# EAGLE design pishield1 (EAGLE 7.6.0)

## Sheet 1 of 2
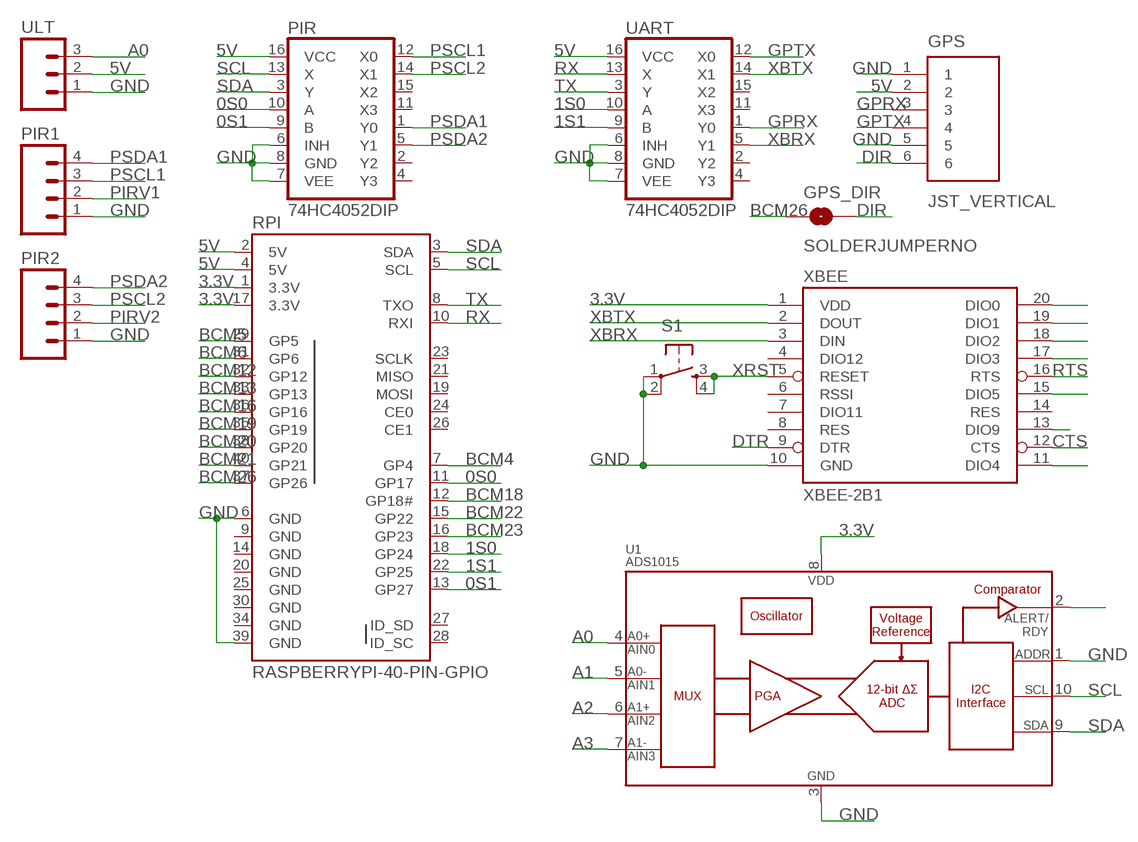
[diagram p0: schematic, sheet 1]

### Parts
GPS  JST_VERTICAL  [JST-6-SMD-VERT-1.0MM]
GPS_DIR  SOLDERJUMPERNO  [SJ_2S-NO]
PIR  74HC4052DIP  [DIL16]
PIR1  M04PTH  [1X04]
PIR2  M04PTH  [1X04]
RPI  RASPBERRYPI-40-PIN-GPIO  [2X20-SHROUDED]
S1  TAC_SWITCHPTH  [TACTILE-PTH]
U1  ADS1015  [MSOP10]
UART  74HC4052DIP  [DIL16]
ULT  M03PTH  [1X03]
XBEE  XBEE-2B1  [XBEE-1]

### Nets
0S0: PIR.10(A) RPI.11(GP17)
0S1: PIR.9(B) RPI.13(GP27)
1S0: RPI.18(GP24) UART.10(A)
1S1: RPI.22(GP25) UART.9(B)
3.3V: RPI.1(3.3V) RPI.17(3.3V) U1.8(VDD) XBEE.1(VDD)
5V: GPS.2 PIR.16(VCC) RPI.2(5V) RPI.4(5V) UART.16(VCC) ULT.2 ; also sheet 2
A0: U1.4(AIN0) ULT.3
A1: U1.5(AIN1)
A2: U1.6(AIN2)
A3: U1.7(AIN3)
BCM4: RPI.7(GP4)
BCM5: RPI.29(GP5)
BCM6: RPI.31(GP6)
BCM12: RPI.32(GP12) ; also sheet 2
BCM13: RPI.33(GP13) ; also sheet 2
BCM16: RPI.36(GP16) ; also sheet 2
BCM18: RPI.12(GP18#)
BCM19: RPI.35(GP19) ; also sheet 2
BCM20: RPI.38(GP20) ; also sheet 2
BCM21: RPI.40(GP21) ; also sheet 2
BCM22: RPI.15(GP22)
BCM23: RPI.16(GP23)
BCM26: GPS_DIR.1 RPI.37(GP26)
CTS: XBEE.12(CTS)
DIR: GPS.6 GPS_DIR.2
DTR: XBEE.9(DTR)
GND: GPS.1 GPS.5 PIR1.1 PIR2.1 PIR.6(INH) PIR.7(VEE) PIR.8(GND) RPI.6(GND) RPI.39(GND) S1.1 S1.2 U1.1(ADDR) U1.3(VSS) UART.6(INH) UART.7(VEE) UART.8(GND) ULT.1 XBEE.10(GND) ; also sheet 2
GPRX: GPS.3 UART.1(Y0)
GPTX: GPS.4 UART.12(X0)
N$6: U1.2(ALERT/RDY)
N$13: XBEE.20(DIO0)
N$19: XBEE.19(DIO1)
N$24: XBEE.18(DIO2)
N$26: XBEE.17(DIO3)
N$32: XBEE.11(DIO4)
N$33: XBEE.15(DIO5)
N$34: XBEE.13(DIO9)
PIRV1: PIR1.2 ; also sheet 2
PIRV2: PIR2.2 ; also sheet 2
PSCL1: PIR1.3 PIR.12(X0)
PSCL2: PIR2.3 PIR.14(X1)
PSDA1: PIR1.4 PIR.1(Y0)
PSDA2: PIR2.4 PIR.5(Y1)
RTS: XBEE.16(RTS)
RX: RPI.10(RXI) UART.13(X)
SCL: PIR.13(X) RPI.5(SCL) U1.10(SCL)
SDA: PIR.3(Y) RPI.3(SDA) U1.9(SDA)
TX: RPI.8(TXO) UART.3(Y)
XBRX: UART.5(Y1) XBEE.3(DIN)
XBTX: UART.14(X1) XBEE.2(DOUT)
XRST: S1.3 S1.4 XBEE.5(RESET)
Unconnected: PIR.2(Y2) PIR.4(Y3) PIR.11(X3) PIR.15(X2) RPI.19(MOSI) RPI.21(MISO) RPI.23(SCLK) RPI.24(CE0) RPI.26(CE1) RPI.27(ID_SD) RPI.28(ID_SC) UART.2(Y2) UART.4(Y3) UART.11(X3) UART.15(X2) XBEE.4(DIO12) XBEE.6(RSSI) XBEE.7(DIO11) XBEE.8(RES) XBEE.14(RES)

## Sheet 2 of 2
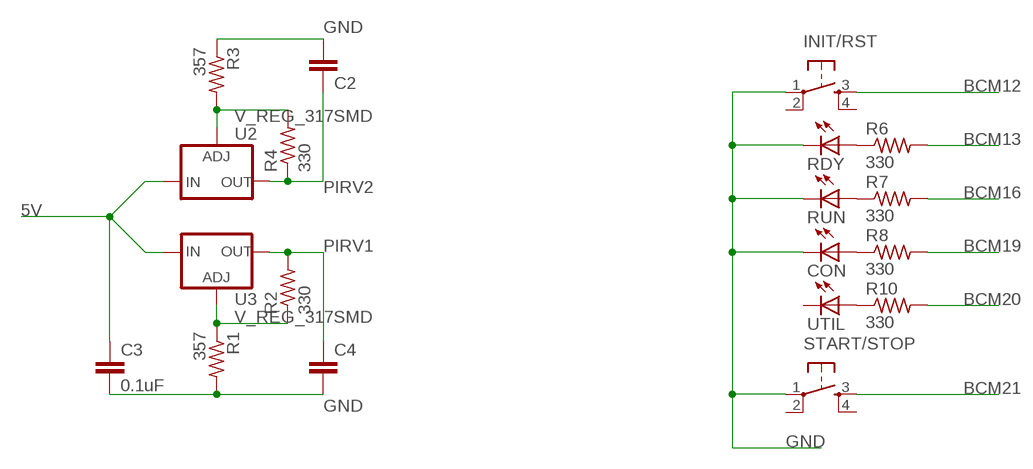
[diagram p1: schematic, sheet 2]

### Parts
C2  CAPPTH  [CAP-PTH-SMALL]
C3  0.1uF  CAPPTH  [CAP-PTH-SMALL]
C4  CAPPTH  [CAP-PTH-SMALL]
CON  LEDSML1206  [SML1206]
INIT/RST  TAC_SWITCHPTH  [TACTILE-PTH]
R1  357  R-US_M0805  [M0805]
R2  330  R-US_M0805  [M0805]
R3  357  R-US_M0805  [M0805]
R4  330  R-US_M0805  [M0805]
R6  330  R-US_M0805  [M0805]
R7  330  R-US_M0805  [M0805]
R8  330  R-US_M0805  [M0805]
R10  330  R-US_M0805  [M0805]
RDY  LEDSML1206  [SML1206]
RUN  LEDSML1206  [SML1206]
START/STOP  TAC_SWITCHPTH  [TACTILE-PTH]
U2  V_REG_317SMD  [SOT223]
U3  V_REG_317SMD  [SOT223]
UTIL  LEDSML1206  [SML1206]

### Nets
5V: C3.1 U2.3(IN) U3.3(IN) ; also sheet 1
BCM12: INIT/RST.3 ; also sheet 1
BCM13: R6.2 ; also sheet 1
BCM16: R7.2 ; also sheet 1
BCM19: R8.2 ; also sheet 1
BCM20: R10.2 ; also sheet 1
BCM21: START/STOP.3 ; also sheet 1
GND: C2.2 C3.2 C4.2 CON.C INIT/RST.1 R1.2 R3.1 RDY.C RUN.C START/STOP.1 ; also sheet 1
N$3: R3.2 R4.2 U2.1(ADJ)
N$5: R6.1 RDY.A
N$7: R7.1 RUN.A
N$8: CON.A R8.1
N$11: R10.1 UTIL.A
N$16: R1.1 R2.1 U3.1(ADJ)
PIRV1: C4.1 R2.2 U3.2(OUT) ; also sheet 1
PIRV2: C2.1 R4.1 U2.2(OUT) ; also sheet 1
Unconnected: INIT/RST.2 INIT/RST.4 START/STOP.2 START/STOP.4 UTIL.C

## Power pins joined to a net without a drawn wire
GND: RPI.9(GND) RPI.14(GND) RPI.20(GND) RPI.25(GND) RPI.30(GND) RPI.34(GND)

## Library data of the parts
C2-C4 = SparkFun-Capacitors:CAP: Capacitor Standard 0603 ceramic capacitor, and 0.1" leaded capacitor.
CON RDY RUN UTIL = led:LED: LED OSRAM: - CHIPLED LG R971, LG N971, LY N971, LG Q971, LY Q971, LO R971, LY R971 LH N974, LH R974 LS Q976, LO Q976, LY Q976 LO Q996 - Hyper CHIPLED LW Q18S LB Q993, LB Q99A, LB R99A - SideLED LS A670, LO A670, LY A670, LG A670, LP A670 LB A673, LV A673, LT A673, LW A673 LH A674 LY A675 LS A676, LA A676, LO A676, LY A676, LW A676 LS A679, LY A679, LG A679 - Hyper Micro SIDELED® LS Y876, LA Y876, LO Y876, LY Y876 LT Y87S - SmartLED LW L88C, LW L88S LB L89C, LB L89S, LG L890 LS L89K, LO L89K, LY L89K LS L896, LA L896, LO L896, LY L896 - TOPLED LS T670, LO T670, LY T670, LG T670, LP T670 LSG T670, LSP T670, LSY T670, LOP T670, LYG T670 LG T671, LOG T671, LSG T671 LB T673, LV T673, LT T673, LW T673 LH T674 LS T676, LA T676, LO T676, LY T676, LB T676, LH T676, LSB T676, LW T676 LB T67C, LV T67C, LT T67C, LS T67K, LO T67K, LY T67K, LW E67C LS E67B, LA E67B, LO E67B, LY E67B, LB E67C, LV E67C, LT E67C LW T67C LS T679, LY T679, LG T679 LS T770, LO T770, LY T770, LG T770, LP T770 LB T773, LV T773, LT T773, LW T773 LH T774 LS E675, LA E675, LY E675, LS T675 LS T776, LA T776, LO T776, LY T776, LB T776 LHGB T686 LT T68C, LB T68C - Hyper Mini TOPLED® LB M676 - Mini TOPLED Santana® LG M470 LS M47K, LO M47K, LY M47K Source: http://www.osram.convergy.de LUXEON: - LUMILED® LXK2-PW12-R00, LXK2-PW12-S00, LXK2-PW14-U00, LXK2-PW14-V00 LXK2-PM12-R00, LXK2-PM12-S00, LXK2-PM14-U00 LXK2-PE12-Q00, LXK2-PE12-R00, LXK2-PE12-S00, LXK2-PE14-T00, LXK2-PE14-U00 LXK2-PB12-K00, LXK2-PB12-L00, LXK2-PB12-M00, LXK2-PB14-N00, LXK2-PB14-P00, LXK2-PB14-Q00 LXK2-PR12-L00, LXK2-PR12-M00, LXK2-PR14-Q00, LXK2-PR14-R00 LXK2-PD12-Q00, LXK2-PD12-R00, LXK2-PD12-S00 LXK2-PH12-R00, LXK2-PH12-S00 LXK2-PL12-P00, LXK2-PL12-Q00, LXK2-PL12-R00 Source: www.luxeon.com KINGBRIGHT: KA-3528ASYC Source: www.kingbright.com
GPS = SparkFun-Connectors:JST_VERTICAL; PROD_ID: CONN-08249
GPS_DIR = SparkFun-Retired:SOLDERJUMPER: Solder Jumper Standard SMD solder jumper. Used to automate production. Two varients : Normally Open and Normally Closed are the same, but have different paste layers. NC will have a large amount of paste and should jumper during reflow.
INIT/RST S1 START/STOP = SparkFun-Retired:TAC_SWITCH: Momentary Switch Button commonly used for reset or general input. Spark Fun Electronics SKU : COM-00097 SMT- SWCH-08247
PIR UART = SparkFun-AnalogIC:74HC4052: Dual 4:1 analog mux
PIR1 PIR2 = SparkFun-Connectors:M04: Header 4 Standard 4-pin 0.1" header. Use with straight break away headers (SKU : PRT-00116), right angle break away headers (PRT-00553), swiss pins (PRT-00743), machine pins (PRT-00117), and female headers (PRT-00115). Molex polarized connector foot print use with SKU : PRT-08231 with associated crimp pins and housings. 1MM SMD Version SKU: PRT-10208; PROD_ID: CONN-09696
R1-R4 R6-R8 R10 = resistor:R-US_: RESISTOR, American symbol
RPI = SparkFun-Boards:RASPBERRYPI-40-PIN-GPIO: Second Generation Raspberry Pi GPIO Header 2x20 pin connector, as found on B, B+, A+ models.
U1 = SparkFun-AnalogIC:ADS1015: 12-Bit Del-Sig ADC Four single-ended inputs or two differential inputs Internal PGA I2C interface 2.0-5.5V; PROD_ID: IC-12239
U2 U3 = SparkFun-PowerIC:V_REG_317: Voltage Regulator Standard LM317 adjustable voltage regulator. AOI (Adjust Output Input). Google 'LM317 Calculator' for easy to use app to get the two resistor values needed. 240/720 for 5V output. 240/390 for 3.3V output. Spark Fun Electronics SKU : COM-00527
ULT = SparkFun-Connectors:M03: Header 3 Standard 3-pin 0.1" header. Use with straight break away headers (SKU : PRT-00116), right angle break away headers (PRT-00553), swiss pins (PRT-00743), machine pins (PRT-00117), and female headers (PRT-00115). Molex polarized connector foot print use with SKU : PRT-08232 with associated crimp pins and housings.
XBEE = SparkFun-RF:XBEE-2: Xbee module footprints SMT header is CONN-09042.

## Board
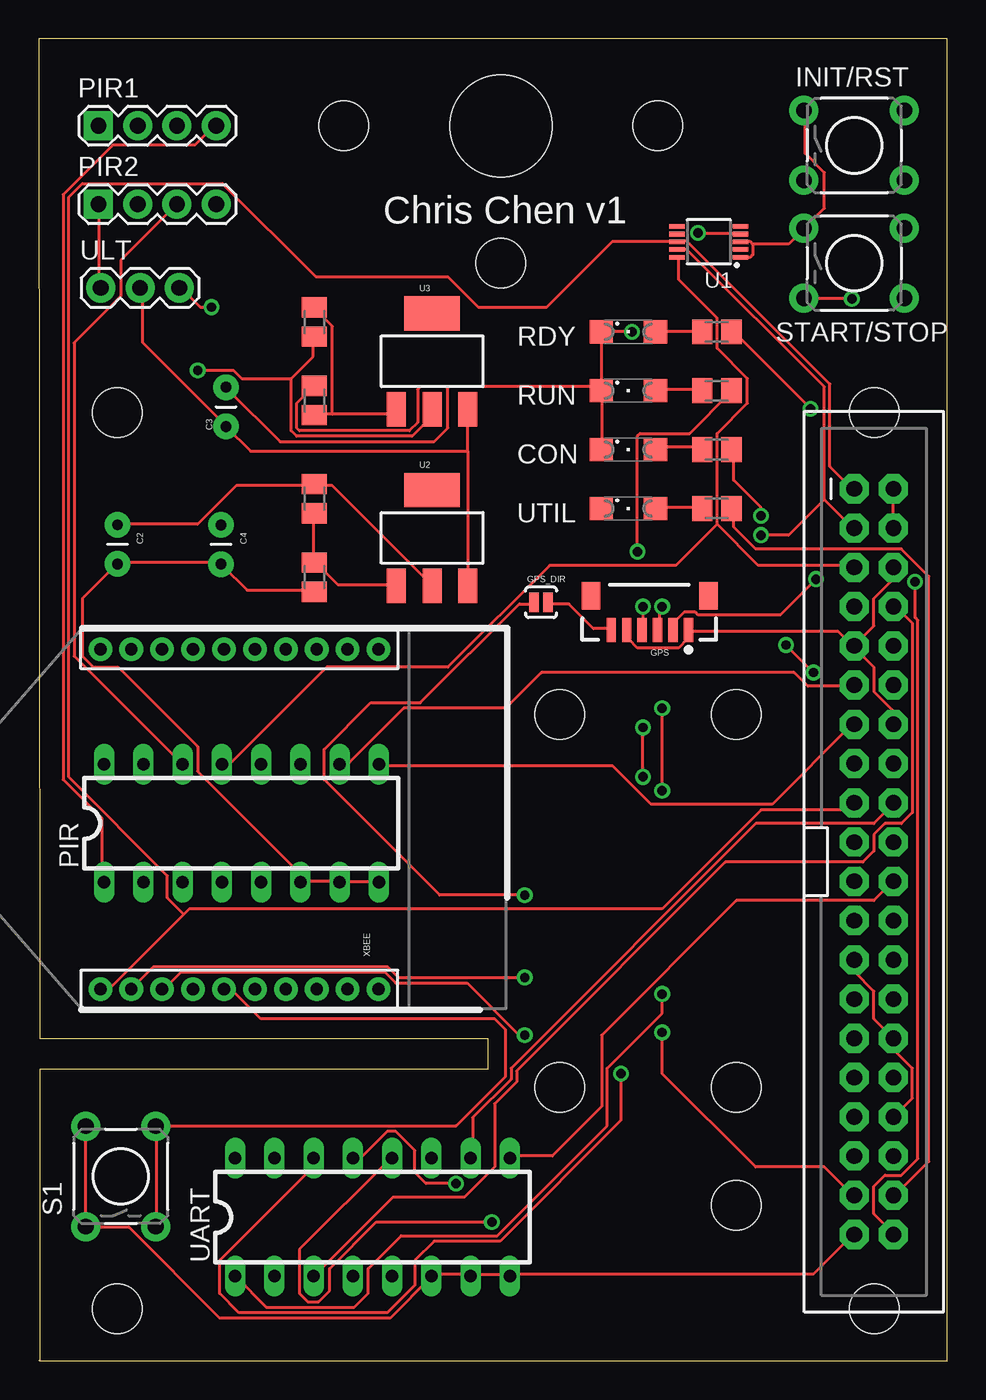
[diagram p2: board, top side]
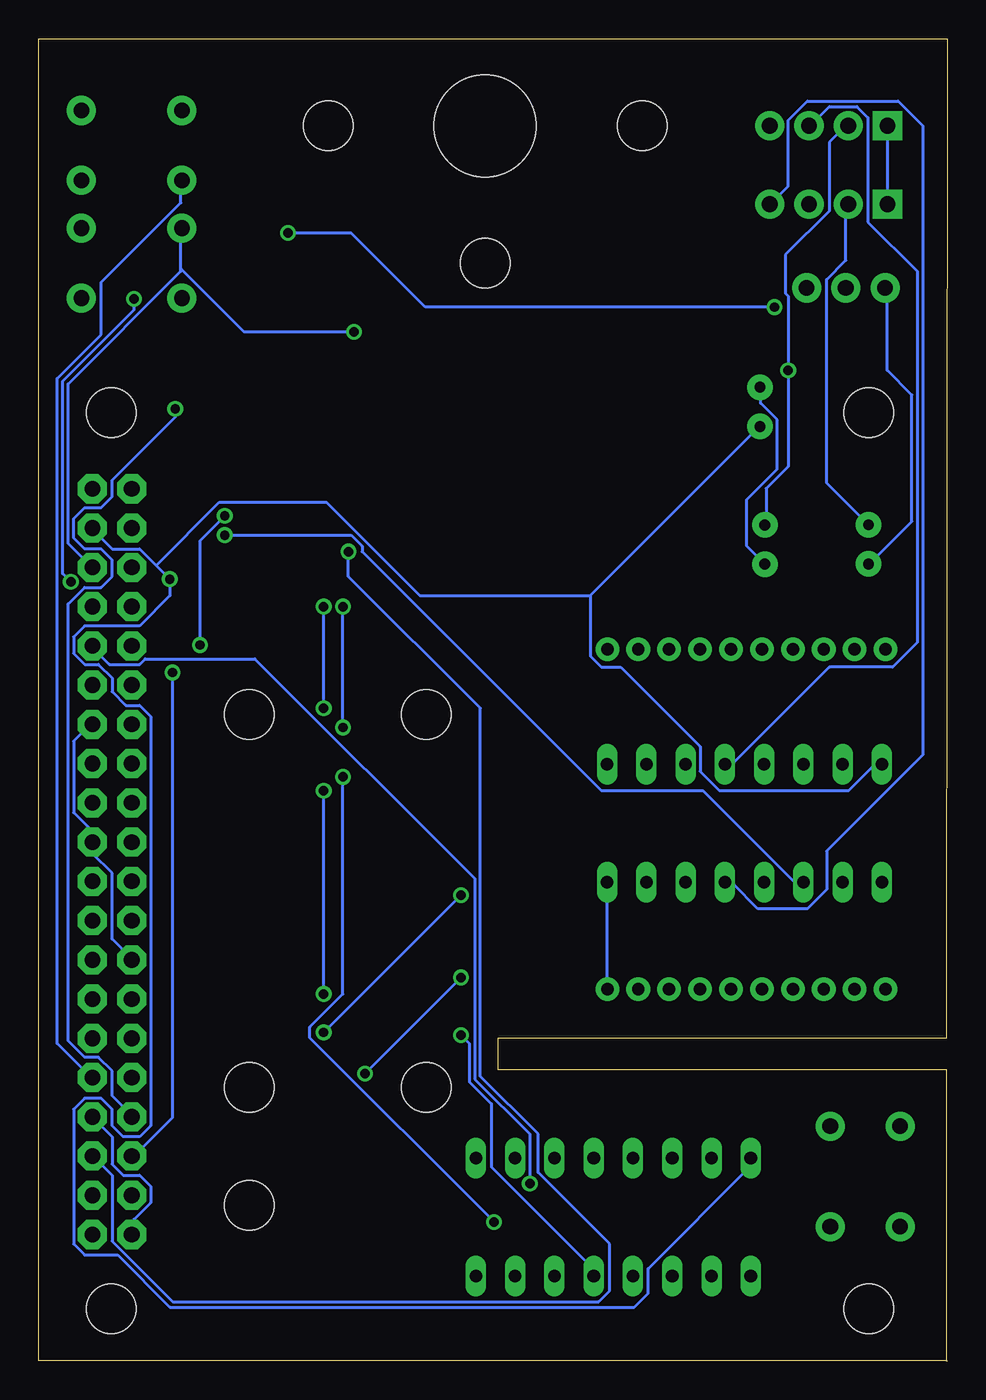
[diagram p3: board, bottom side, seen from below]

Size 58.78 x 85.57 mm. Coordinates in mm from the lower left corner, seen from the top.
Outline: 0.07,0 58.78,0 58.78,85.57 0,85.57 0.07,20.88 29.07,20.88 29.07,18.88 0.07,18.88 0.07,0
Outline: 0.07,0 0,0
Copper layers (1*16): Top 0.035mm / dielectric 1.5mm / Bottom 0.035mm
Design rules "default *": minimum track width 8mil, minimum drill 24mil, track to track 6mil, track to pad 6mil, pad to pad 6mil, via to via 6mil, smd to smd 4mil, copper to edge 40mil, drill to drill 8mil, minimum pad ring 10mil, minimum via ring 8mil, stop-mask expansion 4mil, vias tented up to drill 0mil, thermal gap 10mil
Holes 3.2 mm at 54.07,3.38 54.07,61.38 5.07,3.38 5.07,61.38 19.74,79.93 40.06,79.93 29.9,71.04 33.71,41.83 45.14,41.83 45.14,17.7 33.71,17.7 45.14,10.08
Holes 6.6 mm at 29.9,79.93
tRestrict: area 19.7,69.7 to 40.1,90.2
bRestrict: area 19,69 to 40.8,90.9

### Footprints (pad centres in the part's own frame; a part is rotated, then mirrored left to right if it is on the bottom)
CAP-PTH-SMALL = drill 0.7 pad 1.651: 1 0,0; 2 2.54,0
SML1206 = smd 1.5 x 1.5: A 1.75,0; C -1.75,0
JST-6-SMD-VERT-1.0MM = smd 0.6 x 1.55: 1 -2.54,1.27; 2 -1.54,1.27; 3 -0.54,1.27; 4 0.46,1.27; 5 1.46,1.27; 6 2.46,1.27 | smd 1.2 x 1.8: P$1 -3.84,-0.955; P$2 3.76,-0.955
SJ_2S-NO = smd 0.635 x 1.27: 1 -0.45,0; 2 0.45,0
TACTILE-PTH = drill 1.016 pad 1.88: 1 -3.251,2.261; 2 3.251,2.261; 3 -3.251,-2.261; 4 3.251,-2.261
DIL16 = drill 0.813 long: 1 -8.89,-3.81; 2 -6.35,-3.81; 3 -3.81,-3.81; 4 -1.27,-3.81; 5 1.27,-3.81; 6 3.81,-3.81; 7 6.35,-3.81; 8 8.89,-3.81; 9 8.89,3.81; 10 6.35,3.81; 11 3.81,3.81; 12 1.27,3.81; 13 -1.27,3.81; 14 -3.81,3.81; 15 -6.35,3.81; 16 -8.89,3.81
1X04 = drill 1.016 pad 1.88 square: 1 0,0 | drill 1.016 pad 1.88: 2 2.54,0; 3 5.08,0; 4 7.62,0
M0805 = smd 1.3 x 1.6: 1 -0.95,0; 2 0.95,0
2X20-SHROUDED = drill 1.016 pad 1.88 octagon: 1 -1.27,24.13; 2 1.27,24.13; 3 -1.27,21.59; 4 1.27,21.59; 5 -1.27,19.05; 6 1.27,19.05; 7 -1.27,16.51; 8 1.27,16.51; 9 -1.27,13.97; 10 1.27,13.97; 11 -1.27,11.43; 12 1.27,11.43; 13 -1.27,8.89; 14 1.27,8.89; 15 -1.27,6.35; 16 1.27,6.35; 17 -1.27,3.81; 18 1.27,3.81; 19 -1.27,1.27; 20 1.27,1.27; 21 -1.27,-1.27; 22 1.27,-1.27; 23 -1.27,-3.81; 24 1.27,-3.81; 25 -1.27,-6.35; 26 1.27,-6.35; 27 -1.27,-8.89; 28 1.27,-8.89; 29 -1.27,-11.43; 30 1.27,-11.43; 31 -1.27,-13.97; 32 1.27,-13.97; 33 -1.27,-16.51; 34 1.27,-16.51; 35 -1.27,-19.05; 36 1.27,-19.05; 37 -1.27,-21.59; 38 1.27,-21.59; 39 -1.27,-24.13; 40 1.27,-24.13
MSOP10 = smd 0.3 x 1: 1 -1,-2.05; 2 -0.5,-2.05; 3 0,-2.05; 4 0.5,-2.05; 5 1,-2.05; 6 1,2.05; 7 0.5,2.05; 8 0,2.05; 9 -0.5,2.05; 10 -1,2.05
SOT223 = smd 1.219 x 2.235: 1 -2.311,-3.099; 2 0,-3.099; 3 2.311,-3.099 | smd 3.6 x 2.2: 4 0,3.099
1X03 = drill 1.016 pad 1.88: 1 0,0; 2 2.54,0; 3 5.08,0
XBEE-1 = drill 0.8 pad 1.524: 1 -11,20; 2 -11,18; 3 -11,16; 4 -11,14; 5 -11,12; 6 -11,10; 7 -11,8; 8 -11,6; 9 -11,4; 10 -11,2; 11 11,2; 12 11,4; 13 11,6; 14 11,8; 15 11,10; 16 11,12; 17 11,14; 18 11,16; 19 11,18; 20 11,20

### Placement (x,y rotation side)
C2  5.1,54.11 270 top
C3  12.12,60.47 90 top
C4  11.8,54.1 270 top
CON  38.16,58.98 0 top
GPS  39.5,48.56 180 top
GPS_DIR  32.5,49.1 0 top
INIT/RST  52.76,78.66 0 top
PIR  13.12,34.8 0 top
PIR1  3.86,79.93 0 top
PIR2  3.86,74.85 0 top
R1  17.84,62.15 90 top
R2  17.84,67.23 270 top
R3  17.84,50.72 90 top
R4  17.84,55.8 270 top
R6  43.87,66.59 0 top
R7  43.87,62.79 0 top
R8  43.87,58.98 0 top
R10  43.87,55.16 0 top
RDY  38.16,66.59 0 top
RPI  54.03,32.3 0 top
RUN  38.16,62.79 0 top
S1  5.31,11.94 90 top
START/STOP  52.76,71.04 0 top
U1  43.36,72.42 90 top
U2  25.46,53.26 0 top
U3  25.46,64.69 0 top
UART  21.6,9.3 0 top
ULT  4.02,69.44 0 top
UTIL  38.16,55.16 0 top
XBEE  23.99,35.05 90 top

### Tracks (layer width: path | path; a pad name or v marks a point on that pad's centre or on a via)
0S0
  Top 0.203: PIR.10 19.54,38.68 20.07,38.68 23.63,42.24 30.21,42.24 32.52,44.55 48.87,44.55 49.76,43.66 52.61,43.66 RPI.11
0S1
  Top 0.203: PIR.9 22.03,38.5 37.14,38.5 39.63,36.01 47.45,36.01 52.61,41.17 RPI.13
1S0
  Top 0.203: UART.10 28.07,13.26 28.07,15.74 30.56,18.23 30.56,18.95 46.38,34.77 54.03,34.77 55.27,36.01 RPI.18
1S1
  Top 0.203: UART.9 30.56,13.26 33.23,13.26 36.43,16.46 36.43,21.08 45.14,29.79 54.03,29.79 55.27,31.04 RPI.22
3.3V
  Top 0.203: RPI.1 52.61,56.46 51.18,57.88 51.18,63.22 41.94,72.46 41.41,72.46 U1.8 41.23,72.46 37.14,72.46 32.87,68.2 28.43,68.2 26.47,70.15 17.94,70.15 11.89,76.2 2.82,76.2 1.94,75.31 1.94,37.79 8.33,31.39 8.33,29.97 9.4,28.9 | 9.4,28.9 9.76,29.26 40.34,29.26 46.74,35.66 52.25,35.66 52.61,36.01 RPI.17 | 9.4,28.9 4.6,24.1 4.07,24.1 XBEE.1
5V  (via drill 0.61)
  Top 0.203: 27.77,58.87 13.72,58.87 C3.1 12.07,60.55 6.73,65.88 6.73,69.44 ULT.2 | 27.77,58.87 U3.3 | 27.77,58.87 U2.3 | v50.3,50.59 47.98,48.28 42.65,48.28 42.47,48.46 41.76,48.46 41.05,47.75 41.05,47.39 GPS.2 | RPI.2 55.27,56.28 55.27,53.97 RPI.4
  Bottom 0.203: 23.09,49.53 23.09,45.62 22.38,44.9 21.14,44.9 15.98,39.75 15.98,38.15 14.74,36.9 6.38,36.9 4.78,38.5 4.25,38.5 PIR.16 | 23.09,49.53 12.25,60.37 C3.1 | 51.18,51.48 52.25,52.55 54.03,52.55 55.27,53.79 RPI.4 | 51.18,51.48 v50.3,50.59 50.3,49.53 52.25,47.57 55.81,47.57 56.52,46.86 56.52,45.79 55.81,45.08 54.92,45.08 54.03,44.19 54.03,43.3 53.14,42.41 52.25,42.41 51.54,41.7 51.54,15.21 52.25,14.5 53.32,14.5 54.03,15.21 54.03,16.28 54.74,16.99 55.81,16.99 56.52,16.28 56.52,7.56 55.81,6.85 53.67,6.85 50.3,3.48 20.25,3.48 19.36,4.37 19.36,5.96 12.78,12.54 12.78,13.08 UART.16 | 23.09,49.53 34.12,49.53 40.16,55.57 47.1,55.57 51.18,51.48
A0  (via drill 0.61)
  Top 0.203: v42.65,73 45.32,73 U1.4 | v11.18,68.2 10.47,68.2 9.22,69.44 ULT.3
  Bottom 0.203: v42.65,73 38.56,73 33.76,68.2 v11.18,68.2
BCM12
  Bottom 0.203: INIT/RST.3 49.59,76.37 49.59,74.95 54.74,69.8 54.74,66.42 57.59,63.57 57.59,20.55 55.45,18.41 RPI.32
BCM13  (via drill 0.61)
  Top 0.203: v49.94,61.62 44.96,66.59 R6.2
  Bottom 0.203: v49.94,61.62 49.94,61.08 54.03,56.99 54.03,55.93 54.74,55.22 55.81,55.22 56.52,54.51 56.52,53.26 55.81,52.55 54.74,52.55 54.03,51.84 54.03,50.77 54.74,50.06 55.81,50.06 56.88,48.99 56.88,20.72 55.81,19.66 54.92,19.66 54.03,18.77 54.03,17.17 52.78,15.92 RPI.33
BCM16  (via drill 0.61)
  Top 0.203: v38.74,52.37 38.74,59.84 38.92,60.02 42.12,60.02 44.78,62.68 R7.2
  Bottom 0.203: v38.74,52.37 38.74,50.77 30.21,42.24 30.21,18.41 26.47,14.68 26.47,12.19 21.85,7.56 21.85,4.54 22.56,3.83 50.12,3.83 54.03,7.74 54.03,12.01 55.27,13.26 RPI.36
BCM19  (via drill 0.61)
  Top 0.203: v46.74,54.68 46.74,55.22 44.96,56.99 44.96,58.95 R8.2 | v50.12,44.55 v48.34,46.33
  Bottom 0.203: v46.74,54.68 48.34,53.08 v48.34,46.33 | v50.12,44.55 50.12,15.74 52.61,13.26 RPI.35
BCM20
  Top 0.203: R10.2 44.96,55.04 44.96,53.97 46.38,52.55 55.81,52.55 57.59,50.77 57.59,12.9 55.45,10.77 RPI.38
BCM21  (via drill 0.61)
  Top 0.203: v52.61,68.73 49.59,68.73 START/STOP.3 | v56.7,50.41 56.7,48.1 56.88,47.93 56.88,13.08 55.81,12.01 54.74,12.01 54.03,11.3 54.03,9.52 55.27,8.28 RPI.40
  Bottom 0.203: v52.61,68.73 52.61,68.02 57.23,63.4 57.23,50.95 v56.7,50.41
BCM26  (via drill 0.61)
  Top 0.203: v31.45,30.15 25.94,30.15 18.47,37.61 18.47,39.57 21.49,42.59 24.69,42.59 31.09,48.99 31.98,48.99 GPS_DIR.1 | v40.34,21.26 40.34,18.59 46.38,12.54 50.83,12.54 52.61,10.77 RPI.37
  Bottom 0.203: v40.34,21.26 v31.45,30.15
DIR
  Top 0.203: GPS_DIR.2 33.05,48.99 34.29,48.99 35.89,47.39 36.96,47.39 GPS.6
GND  (via drill 0.61)
  Top 0.203: CON.C 36.43,59.13 36.43,62.68 RUN.C | 36.43,63.04 36.43,62.86 RUN.C | 36.43,63.04 36.43,66.59 | 36.43,63.04 26.47,63.04 | 26.47,63.04 24.69,63.04 24.52,62.86 24.52,60.73 23.98,60.19 16.87,60.19 16.69,60.37 16.69,61.97 17.76,63.04 R1.2 | 36.43,63.04 RUN.C | ULT.1 3.89,69.62 3.89,74.77 PIR2.1 | PIR.8 21.85,31.04 19.54,31.04 PIR.7 19.36,31.04 17.05,31.04 PIR.6 16.87,31.04 16.87,31.57 10.29,38.15 10.29,39.75 5.13,44.9 3.54,44.9 2.82,45.62 2.82,49.35 4.96,51.48 C2.2 5.13,51.66 11.71,51.66 C4.2 11.89,51.48 13.49,49.88 17.76,49.88 R3.1 | 26.47,63.04 26.47,60.37 25.58,59.48 15.62,59.48 12.25,62.86 C3.2 | 46.21,72.28 46.21,71.57 46.03,71.4 45.5,71.4 U1.1 | 46.21,72.28 46.03,72.46 45.5,72.46 U1.3 | 46.21,72.28 48.52,72.28 49.41,73.17 START/STOP.1 49.59,73.35 50.83,74.6 50.83,76.91 49.59,78.15 49.59,80.82 INIT/RST.1 | GPS.5 38.21,47.22 38.21,46.68 38.74,46.15 41.41,46.15 41.94,46.68 41.94,47.22 GPS.1 42.12,47.22 51.72,47.22 52.61,46.33 RPI.9 | RPI.6 55.27,51.3 55.27,50.59 54.03,49.35 54.03,47.57 52.78,46.33 RPI.9 | RPI.14 55.27,41.35 55.27,42.06 54.03,43.3 54.03,44.9 52.78,46.15 RPI.9 | S1.2 3,15.03 3,8.81 S1.1 3.18,8.63 5.85,8.63 11.71,2.77 22.74,2.77 25.4,5.43 UART.6 25.58,5.61 27.89,5.61 UART.7 28.07,5.61 30.38,5.61 UART.8 30.56,5.61 50.12,5.61 52.61,8.1 RPI.39 | RPI.34 55.45,15.92 56.52,16.99 56.52,18.95 55.45,20.01 55.45,20.72 RPI.30 54.03,22.15 54.03,23.92 52.78,25.17 52.78,25.88 RPI.25 | v38.38,66.59 36.43,66.59 | 36.43,66.59 RDY.C
  Bottom 0.203: PIR2.1 3.89,74.95 3.89,79.93 PIR1.1 | XBEE.10 22.03,24.1 22.03,30.86 PIR.8 | C3.2 12.07,62.86 12.07,61.97 11,60.91 11,57.7 12.96,55.75 12.96,52.73 11.89,51.66 C4.2 | ULT.1 3.89,69.44 3.89,64.11 2.29,62.51 2.29,54.33 4.96,51.66 C2.2 | RPI.14 55.45,41.17 56.52,40.1 56.52,35.48 55.45,34.41 55.45,33.7 RPI.20 55.27,33.52 55.27,32.81 54.03,31.57 54.03,27.3 52.78,26.06 RPI.25 | 49.59,70.68 49.59,70.51 56.88,63.22 56.88,52.9 55.45,51.48 RPI.6 | 49.59,70.68 49.59,73.17 START/STOP.1 | RPI.39 52.61,8.28 52.61,9.17 51.54,10.23 51.54,11.3 52.25,12.01 53.32,12.01 54.03,12.72 54.03,14.5 55.27,15.74 RPI.34 | v38.38,66.59 45.5,66.59 49.59,70.68
GPRX  (via drill 0.61)
  Top 0.203: v40.34,48.82 40.16,48.64 40.16,47.39 GPS.3 | v40.34,36.9 v40.34,42.24 | v40.34,23.75 40.34,22.5 36.78,18.95 36.78,15.21 29.67,8.1 23.45,8.1 21.32,5.96 21.32,4.37 20.43,3.48 14.74,3.48 12.78,5.43 UART.1
  Bottom 0.203: v40.34,42.24 v40.34,48.82 | v40.34,23.75 v40.34,36.9
GPTX  (via drill 0.61)
  Top 0.203: v39.09,48.82 39.09,47.39 GPS.4 | v39.09,37.79 v39.09,40.99 | v29.32,8.99 21.85,8.99 18.83,5.96 18.83,4.54 18.11,3.83 17.4,3.83 16.87,4.37 16.87,7.21 22.74,13.08 UART.12
  Bottom 0.203: v39.09,40.99 v39.09,48.82 | v39.09,37.79 39.09,23.75 41.23,21.61 41.23,20.9 v29.32,8.99
N$3
  Top 0.203: R4.2 17.76,54.68 17.76,51.84 R3.2 17.94,51.66 19.36,50.24 23.09,50.24 U2.1
N$5
  Top 0.203: R6.1 RDY.A
N$7
  Top 0.203: RUN.A 39.98,62.86 42.83,62.86 R7.1
N$8
  Top 0.203: CON.A 39.98,59.13 42.83,59.13 R8.1
N$11
  Top 0.203: UTIL.A 39.98,55.22 42.83,55.22 R10.1
N$16
  Top 0.203: 19,61.26 22.92,61.26 23.09,61.44 U3.1 | 19,61.26 17.94,61.26 R1.1 | 19,61.26 19,66.95 17.94,68.02 R2.1
PIRV1  (via drill 0.61)
  Top 0.203: 16.34,63.57 17.76,65 17.76,66.24 R2.2 | 16.34,63.57 16.34,60.19 16.69,59.84 24.16,59.84 25.4,61.08 25.4,61.44 U3.2 | 16.34,63.57 13.14,63.57 12.6,64.11 v10.29,64.11
  Bottom 0.203: C4.1 11.71,54.15 11.71,56.46 10.29,57.88 v10.29,64.11 10.29,68.91 10.47,69.08 10.47,71.57 7.62,74.42 7.62,78.86 6.56,79.93 PIR1.2
PIRV2
  Top 0.203: U2.2 25.4,50.24 19,56.64 17.94,56.64 R4.1 17.76,56.64 12.78,56.64 10.29,54.15 5.13,54.15 C2.1
  Bottom 0.203: PIR2.2 6.56,74.77 6.56,71.22 7.8,69.97 7.8,56.82 5.13,54.15 C2.1
PSCL1
  Bottom 0.203: PIR.12 14.38,38.68 13.85,38.68 7.62,44.9 3.54,44.9 1.94,46.5 1.94,70.51 5.13,73.71 5.13,80.46 5.85,81.17 7.62,81.17 8.87,79.93 PIR1.3
PSCL2
  Top 0.203: PIR2.3 5.31,71.22 5.31,68.91 2.29,65.88 2.29,45.62 9.22,38.68 PIR.14
PSDA1
  Top 0.203: PIR.1 4.07,31.04 4.07,35.12 1.58,37.61 1.58,75.48 4.78,78.69 10.11,78.69 11.36,79.93 PIR1.4
PSDA2
  Bottom 0.203: PIR.5 14.38,30.86 13.85,30.86 12.25,29.26 9.05,29.26 7.8,30.5 7.8,32.99 1.58,39.21 1.58,79.93 3.18,81.53 9.05,81.53 10.29,80.29 10.29,76.02 11.36,74.95 PIR2.4
RX  (via drill 0.61)
  Top 0.203: v27,11.48 25.05,11.48 24.34,12.19 24.34,13.61 23.09,14.86 22.56,14.86 20.96,13.26 20.43,13.26 UART.13
  Bottom 0.203: v27,11.48 27,14.68 30.56,18.23 30.56,31.21 44.78,45.44 51.9,45.44 52.25,45.08 54.21,45.08 55.27,46.15 RPI.10
SCL
  Top 0.203: 43.89,54.15 43.89,60.02 45.85,61.97 45.85,63.57 43.89,65.53 43.89,67.48 41.41,69.97 41.41,71.4 U1.10 | 43.89,54.15 46.56,51.48 52.61,51.48 RPI.5 | 43.89,54.15 41.23,51.48 33.05,51.48 26.47,44.9 18.65,44.9 12.42,38.68 11.89,38.68 PIR.13
SDA  (via drill 0.61)
  Top 0.203: 50.83,55.75 50.83,63.04 41.94,71.93 41.41,71.93 U1.9 | 50.83,55.75 52.61,53.97 RPI.3 | v46.74,53.44 48.52,53.44 50.83,55.75
  Bottom 0.203: v46.74,53.44 38.56,53.44 37.85,52.73 37.85,52.37 22.38,36.9 15.8,36.9 9.94,31.04 9.4,31.04 PIR.3
TX
  Top 0.203: UART.3 17.94,5.61 22.92,10.59 27.54,10.59 29.49,12.54 29.49,16.63 30.92,18.06 30.92,18.77 44.43,32.28 53.32,32.28 54.03,32.99 54.03,34.06 54.74,34.77 55.81,34.77 56.52,35.48 56.52,47.75 55.45,48.82 RPI.8
XBRX  (via drill 0.61)
  Top 0.203: v31.45,21.08 31.09,21.08 27.72,24.46 23.09,24.46 22.38,25.17 9.22,25.17 8.16,24.1 XBEE.3
  Bottom 0.203: v31.45,21.08 30.92,20.55 30.92,18.06 29.49,16.63 29.49,12.54 22.92,5.96 22.92,5.61 UART.5
XBTX  (via drill 0.61)
  Top 0.203: v37.67,18.59 37.67,15.57 29.85,7.74 25.58,7.74 24.34,6.5 24.34,4.9 22.56,3.12 12.96,3.12 11.71,4.37 11.71,6.5 17.76,12.54 17.76,13.08 UART.14 | v31.45,24.81 23.27,24.81 22.56,25.52 7.45,25.52 6.02,24.1 XBEE.2
  Bottom 0.203: v31.45,24.81 v37.67,18.59
XRST
  Top 0.203: XBEE.5 12.07,23.92 12.6,23.92 14.38,22.15 29.49,22.15 30.21,21.43 30.21,18.41 27,15.21 7.62,15.21 S1.4 7.62,15.03 7.62,8.81 S1.3

### Text on the board
tNames: Chris Chen v1